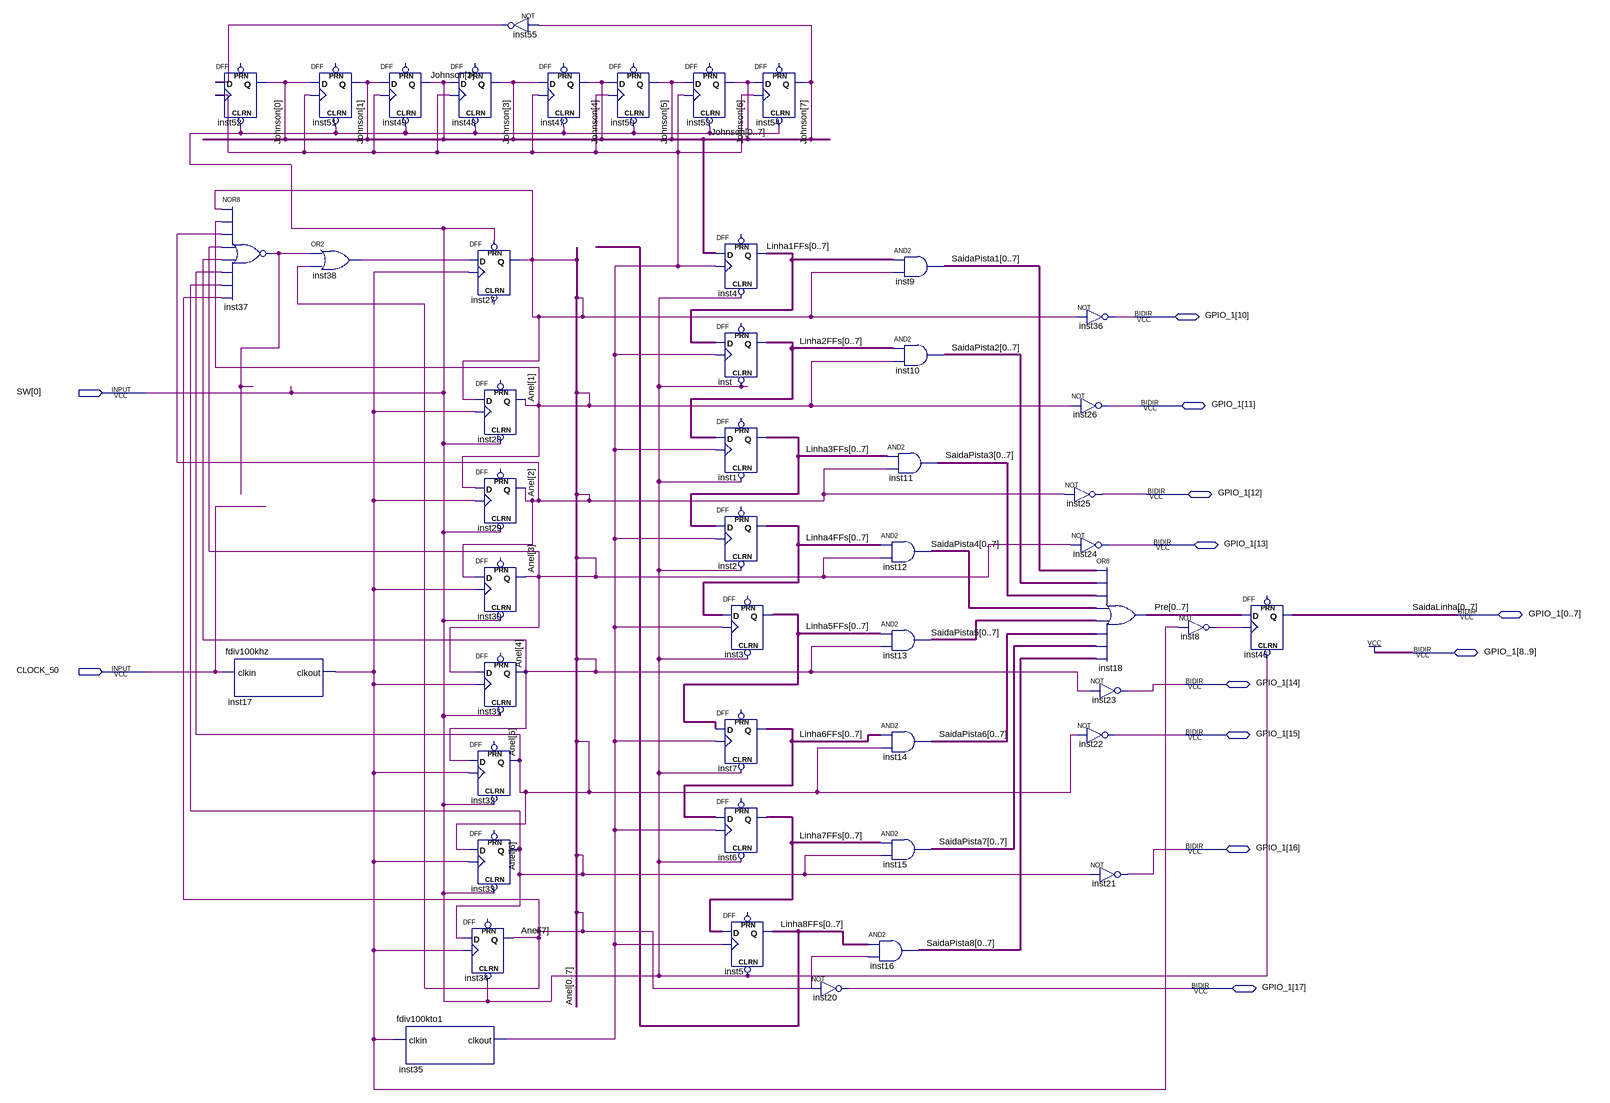
[diagram p0: schematic sheet]
// Quartus schematic PistaB.bdf as structural Verilog: 48 symbols, 12 pins
module PistaB (
  input  [0:0] SW,
  input  CLOCK_50,
  inout  [0:17] GPIO_1
);

  wire inst8_out, inst17_clkout, inst27_q, inst35_clkout, inst37_out, inst38_out, inst55_out;
  wire [7:0] Johnson, Linha1FFs, Linha2FFs, Linha3FFs, Linha4FFs, Linha5FFs, Linha6FFs, Linha7FFs, Linha8FFs,
       Pre, SaidaPista1, SaidaPista2, SaidaPista3, SaidaPista4, SaidaPista5, SaidaPista6, SaidaPista7,
       SaidaPista8;
  wire [7:1] Anel;

  DFF inst52 (.CLRN(SW[0]), .CLK(inst35_clkout), .D(inst55_out), .Q(Johnson[0]));  // open: PRN
  nor inst37 (inst37_out, inst27_q, Anel[1], Anel[2], Anel[3], Anel[4], Anel[5], Anel[6], Anel[7]);
  fdiv100khz inst17 (.clkin(CLOCK_50), .clkout(inst17_clkout));
  DFF inst51 (.CLRN(SW[0]), .CLK(inst35_clkout), .D(Johnson[0]), .Q(Johnson[1]));  // open: PRN
  or inst38 (inst38_out, inst37_out, Anel[7]);
  DFF inst49 (.CLRN(SW[0]), .CLK(inst35_clkout), .D(Johnson[1]), .Q(Johnson[2]));  // open: PRN
  fdiv100kto1 inst35 (.clkin(inst17_clkout), .clkout(inst35_clkout));
  DFF inst48 (.CLRN(SW[0]), .CLK(inst35_clkout), .D(Johnson[2]), .Q(Johnson[3]));  // open: PRN
  DFF inst27 (.CLK(inst17_clkout), .D(inst38_out), .PRN(SW[0]), .Q(inst27_q));  // open: CLRN
  DFF inst28 (.CLRN(SW[0]), .CLK(inst17_clkout), .D(inst27_q), .Q(Anel[1]));  // open: PRN
  DFF inst29 (.CLRN(SW[0]), .CLK(inst17_clkout), .D(Anel[1]), .Q(Anel[2]));  // open: PRN
  DFF inst30 (.CLRN(SW[0]), .CLK(inst17_clkout), .D(Anel[2]), .Q(Anel[3]));  // open: PRN
  DFF inst31 (.CLRN(SW[0]), .CLK(inst17_clkout), .D(Anel[3]), .Q(Anel[4]));  // open: PRN
  DFF inst32 (.CLRN(SW[0]), .CLK(inst17_clkout), .D(Anel[4]), .Q(Anel[5]));  // open: PRN
  DFF inst33 (.CLRN(SW[0]), .CLK(inst17_clkout), .D(Anel[5]), .Q(Anel[6]));  // open: PRN
  DFF inst34 (.CLRN(SW[0]), .CLK(inst17_clkout), .D(Anel[6]), .Q(Anel[7]));  // open: PRN
  not inst55 (inst55_out, Johnson[7]);
  DFF inst47 (.CLRN(SW[0]), .CLK(inst35_clkout), .D(Johnson[3]), .Q(Johnson[4]));  // open: PRN
  DFF inst50 (.CLRN(SW[0]), .CLK(inst35_clkout), .D(Johnson[4]), .Q(Johnson[5]));  // open: PRN
  DFF inst53 (.CLRN(SW[0]), .CLK(inst35_clkout), .D(Johnson[5]), .Q(Johnson[6]));  // open: PRN
  DFF inst4[7:0] (
    .CLRN(SW[0]), .CLK(inst35_clkout),
    .D({Johnson[0], Johnson[1], Johnson[2], Johnson[3], Johnson[4], Johnson[5], Johnson[6], Johnson[7]}),
    .Q({Linha1FFs[0], Linha1FFs[1], Linha1FFs[2], Linha1FFs[3], Linha1FFs[4], Linha1FFs[5], Linha1FFs[6], Linha1FFs[7]}));  // open: PRN
  DFF inst[7:0] (
    .CLRN(SW[0]), .CLK(inst35_clkout),
    .D({Linha1FFs[0], Linha1FFs[1], Linha1FFs[2], Linha1FFs[3], Linha1FFs[4], Linha1FFs[5], Linha1FFs[6], Linha1FFs[7]}),
    .Q({Linha2FFs[0], Linha2FFs[1], Linha2FFs[2], Linha2FFs[3], Linha2FFs[4], Linha2FFs[5], Linha2FFs[6], Linha2FFs[7]}));  // open: PRN
  DFF inst1[7:0] (
    .CLRN(SW[0]), .CLK(inst35_clkout),
    .D({Linha2FFs[0], Linha2FFs[1], Linha2FFs[2], Linha2FFs[3], Linha2FFs[4], Linha2FFs[5], Linha2FFs[6], Linha2FFs[7]}),
    .Q({Linha3FFs[0], Linha3FFs[1], Linha3FFs[2], Linha3FFs[3], Linha3FFs[4], Linha3FFs[5], Linha3FFs[6], Linha3FFs[7]}));  // open: PRN
  DFF inst2[7:0] (
    .CLRN(SW[0]), .CLK(inst35_clkout),
    .D({Linha3FFs[0], Linha3FFs[1], Linha3FFs[2], Linha3FFs[3], Linha3FFs[4], Linha3FFs[5], Linha3FFs[6], Linha3FFs[7]}),
    .Q({Linha4FFs[0], Linha4FFs[1], Linha4FFs[2], Linha4FFs[3], Linha4FFs[4], Linha4FFs[5], Linha4FFs[6], Linha4FFs[7]}));  // open: PRN
  DFF inst3[7:0] (
    .CLRN(SW[0]), .CLK(inst35_clkout),
    .D({Linha4FFs[0], Linha4FFs[1], Linha4FFs[2], Linha4FFs[3], Linha4FFs[4], Linha4FFs[5], Linha4FFs[6], Linha4FFs[7]}),
    .Q({Linha5FFs[0], Linha5FFs[1], Linha5FFs[2], Linha5FFs[3], Linha5FFs[4], Linha5FFs[5], Linha5FFs[6], Linha5FFs[7]}));  // open: PRN
  DFF inst7[7:0] (
    .CLRN(SW[0]), .CLK(inst35_clkout),
    .D({Linha5FFs[0], Linha5FFs[1], Linha5FFs[2], Linha5FFs[3], Linha5FFs[4], Linha5FFs[5], Linha5FFs[6], Linha5FFs[7]}),
    .Q({Linha6FFs[0], Linha6FFs[1], Linha6FFs[2], Linha6FFs[3], Linha6FFs[4], Linha6FFs[5], Linha6FFs[6], Linha6FFs[7]}));  // open: PRN
  DFF inst6[7:0] (
    .CLRN(SW[0]), .CLK(inst35_clkout),
    .D({Linha6FFs[0], Linha6FFs[1], Linha6FFs[2], Linha6FFs[3], Linha6FFs[4], Linha6FFs[5], Linha6FFs[6], Linha6FFs[7]}),
    .Q({Linha7FFs[0], Linha7FFs[1], Linha7FFs[2], Linha7FFs[3], Linha7FFs[4], Linha7FFs[5], Linha7FFs[6], Linha7FFs[7]}));  // open: PRN
  DFF inst5[7:0] (
    .CLRN(SW[0]), .CLK(inst35_clkout),
    .D({Linha7FFs[0], Linha7FFs[1], Linha7FFs[2], Linha7FFs[3], Linha7FFs[4], Linha7FFs[5], Linha7FFs[6], Linha7FFs[7]}),
    .Q({Linha8FFs[0], Linha8FFs[1], Linha8FFs[2], Linha8FFs[3], Linha8FFs[4], Linha8FFs[5], Linha8FFs[6], Linha8FFs[7]}));  // open: PRN
  DFF inst54 (.CLRN(SW[0]), .CLK(inst35_clkout), .D(Johnson[6]), .Q(Johnson[7]));  // open: PRN
  not inst20 (GPIO_1[17], Anel[7]);
  assign {SaidaPista3[0], SaidaPista3[1], SaidaPista3[2], SaidaPista3[3], SaidaPista3[4], SaidaPista3[5], SaidaPista3[6], SaidaPista3[7]} = {Linha3FFs[0], Linha3FFs[1], Linha3FFs[2], Linha3FFs[3], Linha3FFs[4], Linha3FFs[5], Linha3FFs[6], Linha3FFs[7]} & {8{Anel[2]}};  // AND2 inst11, 8 bits wide
  assign {SaidaPista4[0], SaidaPista4[1], SaidaPista4[2], SaidaPista4[3], SaidaPista4[4], SaidaPista4[5], SaidaPista4[6], SaidaPista4[7]} = {Linha4FFs[0], Linha4FFs[1], Linha4FFs[2], Linha4FFs[3], Linha4FFs[4], Linha4FFs[5], Linha4FFs[6], Linha4FFs[7]} & {8{Anel[3]}};  // AND2 inst12, 8 bits wide
  assign {SaidaPista5[0], SaidaPista5[1], SaidaPista5[2], SaidaPista5[3], SaidaPista5[4], SaidaPista5[5], SaidaPista5[6], SaidaPista5[7]} = {Linha5FFs[0], Linha5FFs[1], Linha5FFs[2], Linha5FFs[3], Linha5FFs[4], Linha5FFs[5], Linha5FFs[6], Linha5FFs[7]} & {8{Anel[4]}};  // AND2 inst13, 8 bits wide
  assign {SaidaPista6[0], SaidaPista6[1], SaidaPista6[2], SaidaPista6[3], SaidaPista6[4], SaidaPista6[5], SaidaPista6[6], SaidaPista6[7]} = {Linha6FFs[0], Linha6FFs[1], Linha6FFs[2], Linha6FFs[3], Linha6FFs[4], Linha6FFs[5], Linha6FFs[6], Linha6FFs[7]} & {8{Anel[5]}};  // AND2 inst14, 8 bits wide
  assign {SaidaPista7[0], SaidaPista7[1], SaidaPista7[2], SaidaPista7[3], SaidaPista7[4], SaidaPista7[5], SaidaPista7[6], SaidaPista7[7]} = {Linha7FFs[0], Linha7FFs[1], Linha7FFs[2], Linha7FFs[3], Linha7FFs[4], Linha7FFs[5], Linha7FFs[6], Linha7FFs[7]} & {8{Anel[6]}};  // AND2 inst15, 8 bits wide
  assign {SaidaPista8[0], SaidaPista8[1], SaidaPista8[2], SaidaPista8[3], SaidaPista8[4], SaidaPista8[5], SaidaPista8[6], SaidaPista8[7]} = {Linha8FFs[0], Linha8FFs[1], Linha8FFs[2], Linha8FFs[3], Linha8FFs[4], Linha8FFs[5], Linha8FFs[6], Linha8FFs[7]} & {8{Anel[7]}};  // AND2 inst16, 8 bits wide
  assign {SaidaPista1[0], SaidaPista1[1], SaidaPista1[2], SaidaPista1[3], SaidaPista1[4], SaidaPista1[5], SaidaPista1[6], SaidaPista1[7]} = {Linha1FFs[0], Linha1FFs[1], Linha1FFs[2], Linha1FFs[3], Linha1FFs[4], Linha1FFs[5], Linha1FFs[6], Linha1FFs[7]} & {8{inst27_q}};  // AND2 inst9, 8 bits wide
  assign {SaidaPista2[0], SaidaPista2[1], SaidaPista2[2], SaidaPista2[3], SaidaPista2[4], SaidaPista2[5], SaidaPista2[6], SaidaPista2[7]} = {Linha2FFs[0], Linha2FFs[1], Linha2FFs[2], Linha2FFs[3], Linha2FFs[4], Linha2FFs[5], Linha2FFs[6], Linha2FFs[7]} & {8{Anel[1]}};  // AND2 inst10, 8 bits wide
  not inst36 (GPIO_1[10], inst27_q);
  not inst26 (GPIO_1[11], Anel[1]);
  not inst25 (GPIO_1[12], Anel[2]);
  not inst24 (GPIO_1[13], Anel[3]);
  not inst23 (GPIO_1[14], Anel[4]);
  not inst22 (GPIO_1[15], Anel[5]);
  not inst21 (GPIO_1[16], Anel[6]);
  assign {Pre[0], Pre[1], Pre[2], Pre[3], Pre[4], Pre[5], Pre[6], Pre[7]} = {SaidaPista1[0], SaidaPista1[1], SaidaPista1[2], SaidaPista1[3], SaidaPista1[4], SaidaPista1[5], SaidaPista1[6], SaidaPista1[7]} | {SaidaPista2[0], SaidaPista2[1], SaidaPista2[2], SaidaPista2[3], SaidaPista2[4], SaidaPista2[5], SaidaPista2[6], SaidaPista2[7]} | {SaidaPista3[0], SaidaPista3[1], SaidaPista3[2], SaidaPista3[3], SaidaPista3[4], SaidaPista3[5], SaidaPista3[6], SaidaPista3[7]} | {SaidaPista4[0], SaidaPista4[1], SaidaPista4[2], SaidaPista4[3], SaidaPista4[4], SaidaPista4[5], SaidaPista4[6], SaidaPista4[7]} | {SaidaPista5[0], SaidaPista5[1], SaidaPista5[2], SaidaPista5[3], SaidaPista5[4], SaidaPista5[5], SaidaPista5[6], SaidaPista5[7]} | {SaidaPista6[0], SaidaPista6[1], SaidaPista6[2], SaidaPista6[3], SaidaPista6[4], SaidaPista6[5], SaidaPista6[6], SaidaPista6[7]} | {SaidaPista7[0], SaidaPista7[1], SaidaPista7[2], SaidaPista7[3], SaidaPista7[4], SaidaPista7[5], SaidaPista7[6], SaidaPista7[7]} | {SaidaPista8[0], SaidaPista8[1], SaidaPista8[2], SaidaPista8[3], SaidaPista8[4], SaidaPista8[5], SaidaPista8[6], SaidaPista8[7]};  // OR8 inst18, 8 bits wide
  not inst8 (inst8_out, inst17_clkout);
  DFF inst46[7:0] (
    .CLRN(SW[0]), .CLK(inst8_out), .D({Pre[0], Pre[1], Pre[2], Pre[3], Pre[4], Pre[5], Pre[6], Pre[7]}),
    .Q(GPIO_1[0:7]));  // open: PRN
  // also tied to VCC on the sheet: GPIO_1[8:9]

  // Other names for the same wires on the sheet: SaidaLinha[7:0] = {GPIO_1[7], GPIO_1[6], GPIO_1[5], GPIO_1[4], GPIO_1[3], GPIO_1[2], GPIO_1[1], GPIO_1[0]}
endmodule
